# Altium schematic sheet Motor Interface.SchDoc: Motor Interface
size Tabloid; CompanyName: Vertex; Organization: Vertex Downhole Ltd.; Address1: 10911 50th Street SE; Address2: Calgary, AB; Address3: T2C 3E5; Address4: Canada; DocumentNumber: 550014; Revision: 4.1; SheetNumber: 3; SheetTotal: 8
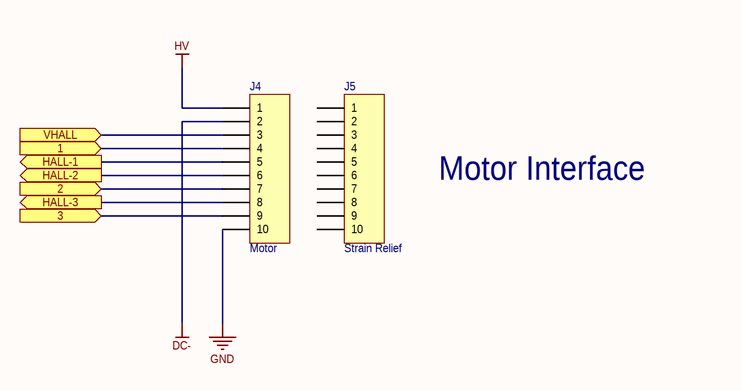
[diagram p0: Motor Interface.SchDoc]

## Parts
J4  Motor  [HDR1X10]
J5  Strain Relief  [HDR1X10]

## Ports
1 (in), 2 (in), 3 (in), HALL-1 (out), HALL-2 (out), HALL-3 (out), VHALL (in)

## Nets
DC-: J4.2
GND: J4.10
HV: J4.1
1: J4.4 ; port 1
2: J4.7 ; port 2
3: J4.9 ; port 3
HALL-1: J4.5 ; port HALL-1
HALL-2: J4.6 ; port HALL-2
HALL-3: J4.8 ; port HALL-3
VHALL: J4.3 ; port VHALL

Not connected (* = marked no-connect by the designer): J5 1 2 3 4 5 6 7 8 9 10

## Notes on the sheet
- Motor Interface
- Title
- Size:
- Date:
- Tabloid
- Number:
- Time:
- Revision:
- Sheet
- of
- File:

## Library data of the parts
J4 J5 = Header 10: Header, 10-Pin